# EAGLE design Final Schematic (EAGLE 6.5.0)
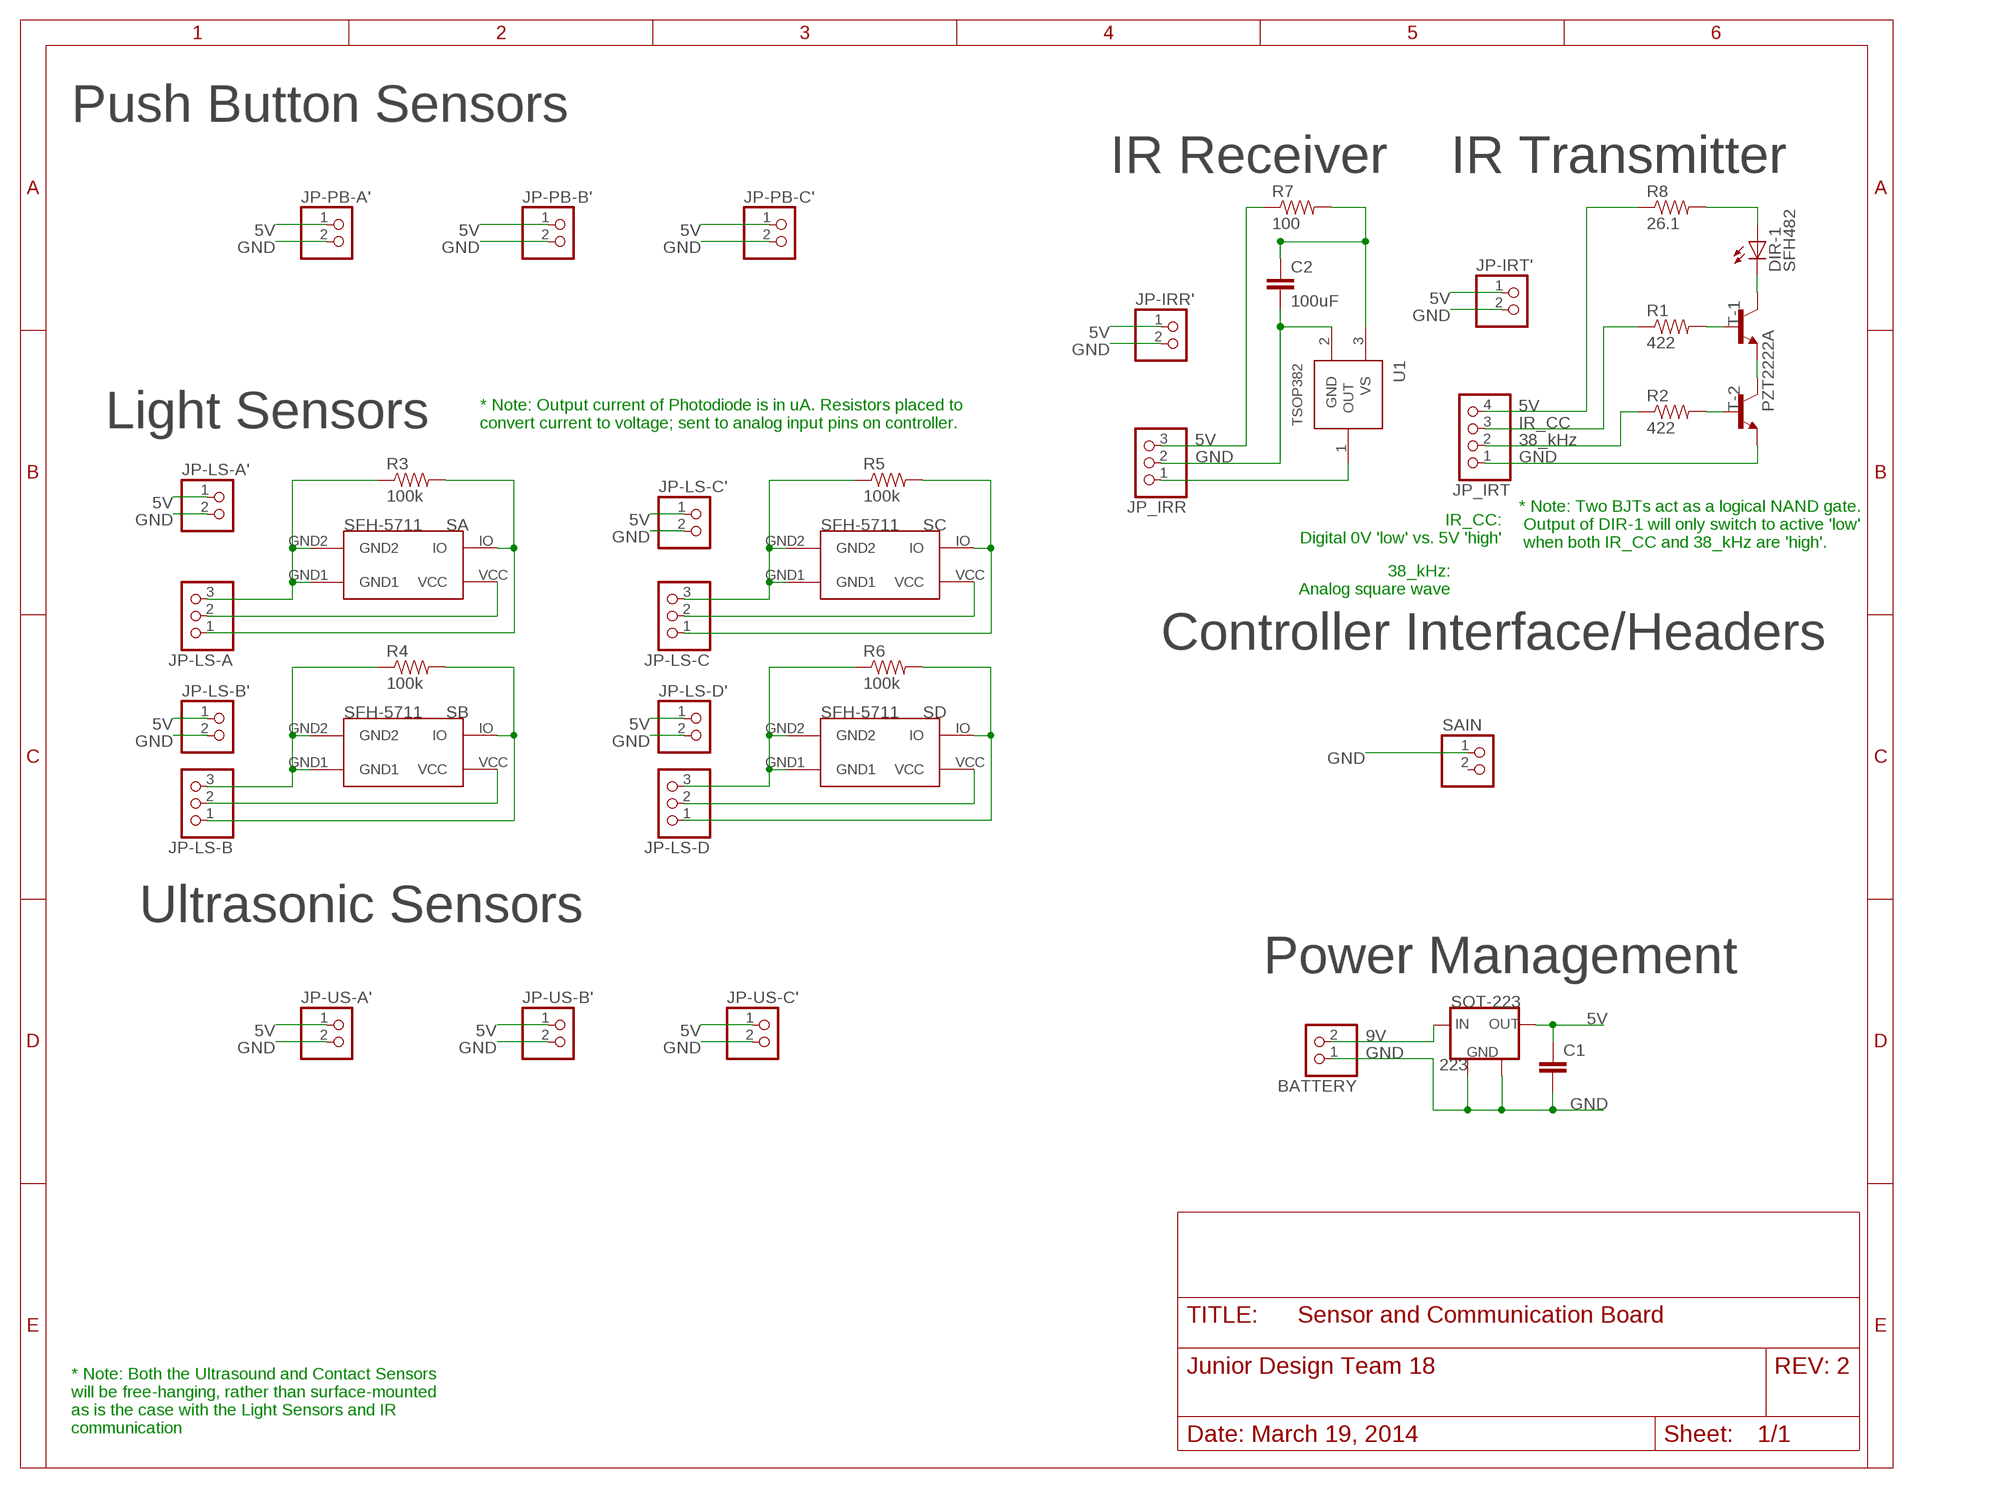
[diagram p0: schematic, sheet 1]

## Parts
BATTERY  PINHD-1X2  [1X02]
C1  CAP0603-CAP  [0603-CAP]
C2  100uF  CAP1206  [1206]
DIR-1  SFH482  [SFH482]
JP-IRR'  PINHD-1X2  [1X02]
JP-IRT'  PINHD-1X2  [1X02]
JP-LS-A  PINHD-1X3  [1X03]
JP-LS-A'  PINHD-1X2  [1X02]
JP-LS-B  PINHD-1X3  [1X03]
JP-LS-B'  PINHD-1X2  [1X02]
JP-LS-C  PINHD-1X3  [1X03]
JP-LS-C'  PINHD-1X2  [1X02]
JP-LS-D  PINHD-1X3  [1X03]
JP-LS-D'  PINHD-1X2  [1X02]
JP-PB-A'  PINHD-1X2  [1X02]
JP-PB-B'  PINHD-1X2  [1X02]
JP-PB-C'  PINHD-1X2  [1X02]
JP-US-A'  PINHD-1X2  [1X02]
JP-US-B'  PINHD-1X2  [1X02]
JP-US-C'  PINHD-1X2  [1X02]
JP_IRR  PINHD-1X3  [1X03]
JP_IRT  PINHD-1X4  [1X04]
R1  422  RESISTOR2512  [R2512]
R2  422  RESISTOR2512  [R2512]
R3  100k  RESISTOR0805-RES  [0805]
R4  100k  RESISTOR0805-RES  [0805]
R5  100k  RESISTOR0805-RES  [0805]
R6  100k  RESISTOR0805-RES  [0805]
R7  100  RESISTOR0805-RES  [0805]
R8  26.1  RESISTOR2512  [R2512]
SAIN  PINHD-1X2  [1X02]
SFH-5711-A  5711  SFH5711  [DIODE]
SFH-5711-B  5711  SFH5711  [DIODE]
SFH-5711-C  5711  SFH5711  [DIODE]
SFH-5711-D  5711  SFH5711  [DIODE]
SOT-223  223  V_REG_LM1117SOT223  [SOT223]
T-1  PZT2222A  [SOT223]
T-2  PZT2222A  [SOT223]
U1  TSOP382  [TSOP382]

## Nets
5V: C1.1 JP-IRR'.1 JP-IRT'.1 JP-LS-A'.1 JP-LS-B'.1 JP-LS-C'.1 JP-LS-D'.1 JP-PB-A'.1 JP-PB-B'.1 JP-PB-C'.1 JP-US-A'.1 JP-US-B'.1 JP-US-C'.1 SOT-223.GND1(OUT)
9V-BAT: BATTERY.2 SOT-223.OUT(IN)
GND: BATTERY.1 C1.2 JP-IRR'.2 JP-IRT'.2 JP-LS-A'.2 JP-LS-B'.2 JP-LS-C'.2 JP-LS-D'.2 JP-PB-A'.2 JP-PB-B'.2 JP-PB-C'.2 JP-US-A'.2 JP-US-B'.2 JP-US-C'.2 SAIN.1 SOT-223.GND2(GND1) SOT-223.IN(GND2)
GND-IR-R: C2.2 JP_IRR.2 U1.2(GND)
GND-IR-T: JP_IRT.1 T-2.3(E)
GND-LS-A: JP-LS-A.3 R3.1 SFH-5711-A.GND1 SFH-5711-A.GND2
GND-LS-B: JP-LS-B.3 R4.1 SFH-5711-B.GND1 SFH-5711-B.GND2
GND-LS-C: JP-LS-C.3 R5.1 SFH-5711-C.GND1 SFH-5711-C.GND2
GND-LS-D: JP-LS-D.3 R6.1 SFH-5711-D.GND1 SFH-5711-D.GND2
IO-LS-A: JP-LS-A.1 R3.2 SFH-5711-A.IO
IO-LS-B: JP-LS-B.1 R4.2 SFH-5711-B.IO
IO-LS-C: JP-LS-C.1 R5.2 SFH-5711-C.IO
IO-LS-D: JP-LS-D.1 R6.2 SFH-5711-D.IO
N$1: DIR-1.A R8.2
N$2: DIR-1.K(C) T-1.2(C) T-1.4(C)
N$4: R2.2 T-2.1(B)
N$5: R1.2 T-1.1(B)
N$6: T-1.3(E) T-2.2(C) T-2.4(C)
VCC-IR-R: JP_IRR.3 R7.1
VCC-IR-T: JP_IRT.4 R8.1
VCC-LS-A: JP-LS-A.2 SFH-5711-A.VCC
VCC-LS-B: JP-LS-B.2 SFH-5711-B.VCC
VCC-LS-C: JP-LS-C.2 SFH-5711-C.VCC
VCC-LS-D: JP-LS-D.2 SFH-5711-D.VCC
VIN-IR-1: JP_IRT.3 R1.1
VIN-IR-2: JP_IRT.2 R2.1
VOUT-IR-R: JP_IRR.1 U1.1(OUT)
VS-IR-R: C2.1 R7.2 U1.3(VS)
Unconnected: SAIN.2

## Notes on the sheet
- Push Button Sensors
- IR Receiver | IR Transmitter
- 5V | 5V | 5V
- GND | GND | GND
- 5V
- GND
- 5V
- GND
- 5V
- Light Sensors
- * Note: Output current of Photodiode is in uA. Resistors placed to
  convert current to voltage; sent to analog input pins on controller.
- IR_CC
- 5V | 38_kHz
- GND | GND
- 5V
- GND | 5V
- IR_CC:
  Digital 0V 'low' vs. 5V 'high'
- SFH-5711 | SA | GND | SFH-5711 | SC
- * Note: Two BJTs act as a logical NAND gate.
   Output of DIR-1 will only switch to active 'low'
   when both IR_CC and 38_kHz are 'high'.
- 38_kHz:
  Analog square wave
- Controller Interface/Headers
- 5V | SFH-5711 | SB | 5V | SFH-5711 | SD
- GND | GND
- GND
- Ultrasonic Sensors
- Power Management
- 5V | 5V | 5V | 5V
- GND | GND | GND | 9V
- GND
- GND
- * Note: Both the Ultrasound and Contact Sensors
  will be free-hanging, rather than surface-mounted
  as is the case with the Light Sensors and IR
  communication

## Library data of the parts
BATTERY JP-IRR' JP-IRT' JP-LS-A' JP-LS-B' JP-LS-C' JP-LS-D' JP-PB-A' JP-PB-B' JP-PB-C' JP-US-A' JP-US-B' JP-US-C' SAIN = pinhead:PINHD-1X2: PIN HEADER
C1 C2 = beacon_board:CAP: Capacitor Standard 0603 ceramic capacitor, and 0.1" leaded capacitor.
DIR-1 = led:SFH482: IR LED infrared emitting diode, Infineon
JP-LS-A JP-LS-B JP-LS-C JP-LS-D JP_IRR = pinhead:PINHD-1X3: PIN HEADER
JP_IRT = pinhead:PINHD-1X4: PIN HEADER
R1-R8 = beacon_board:RESISTOR: Resistor Basic schematic elements and footprints for 0603, 1206, and PTH resistors.
SFH-5711-A SFH-5711-B SFH-5711-C SFH-5711-D = JDT-18:SFH5711: SFH 5711 - Photodiode with Built-In Current Amplifier
SOT-223 = JDT-18:V_REG_LM1117: Voltage Regulator LM1117 Standard adjustable voltage regulator but in SMD form. Spark Fun Electronics SKU : COM-00595
T-1 T-2 = beacon_board:PZT2222A
U1 = beacon_board:TSOP382: Vishay IR receiver module

## Net classes
0 default: width 0.152 mm, drill 0.33 mm

## Board
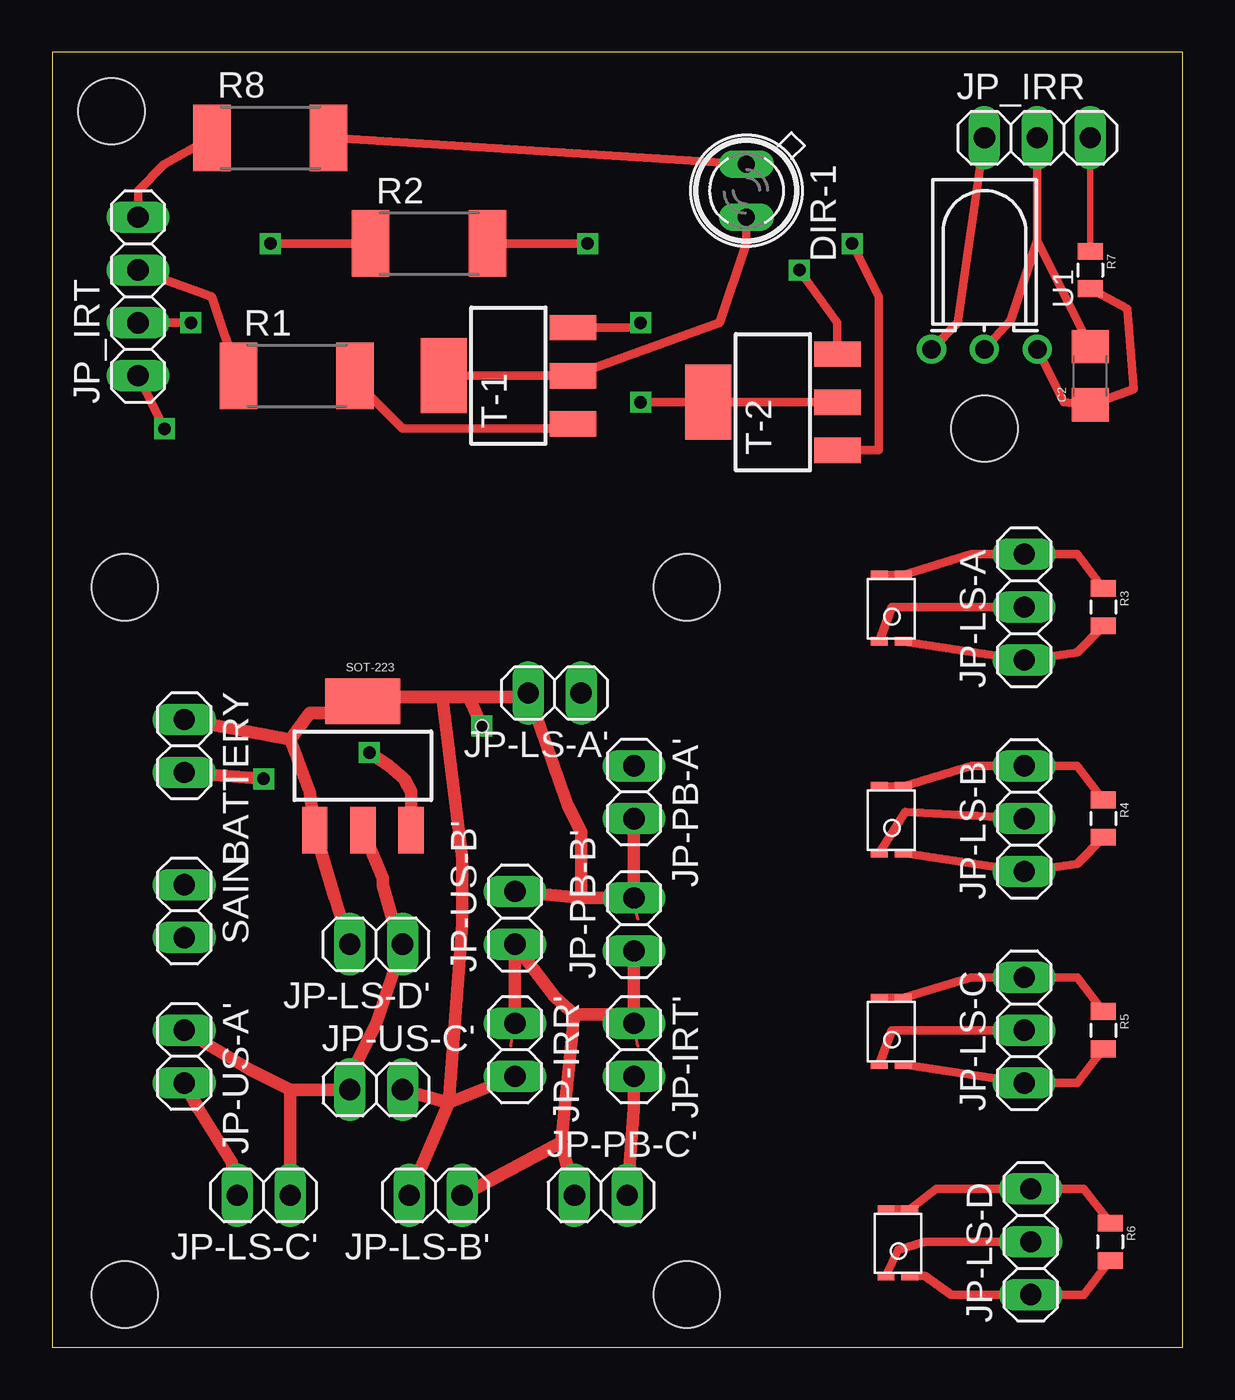
[diagram p1: board, top side]
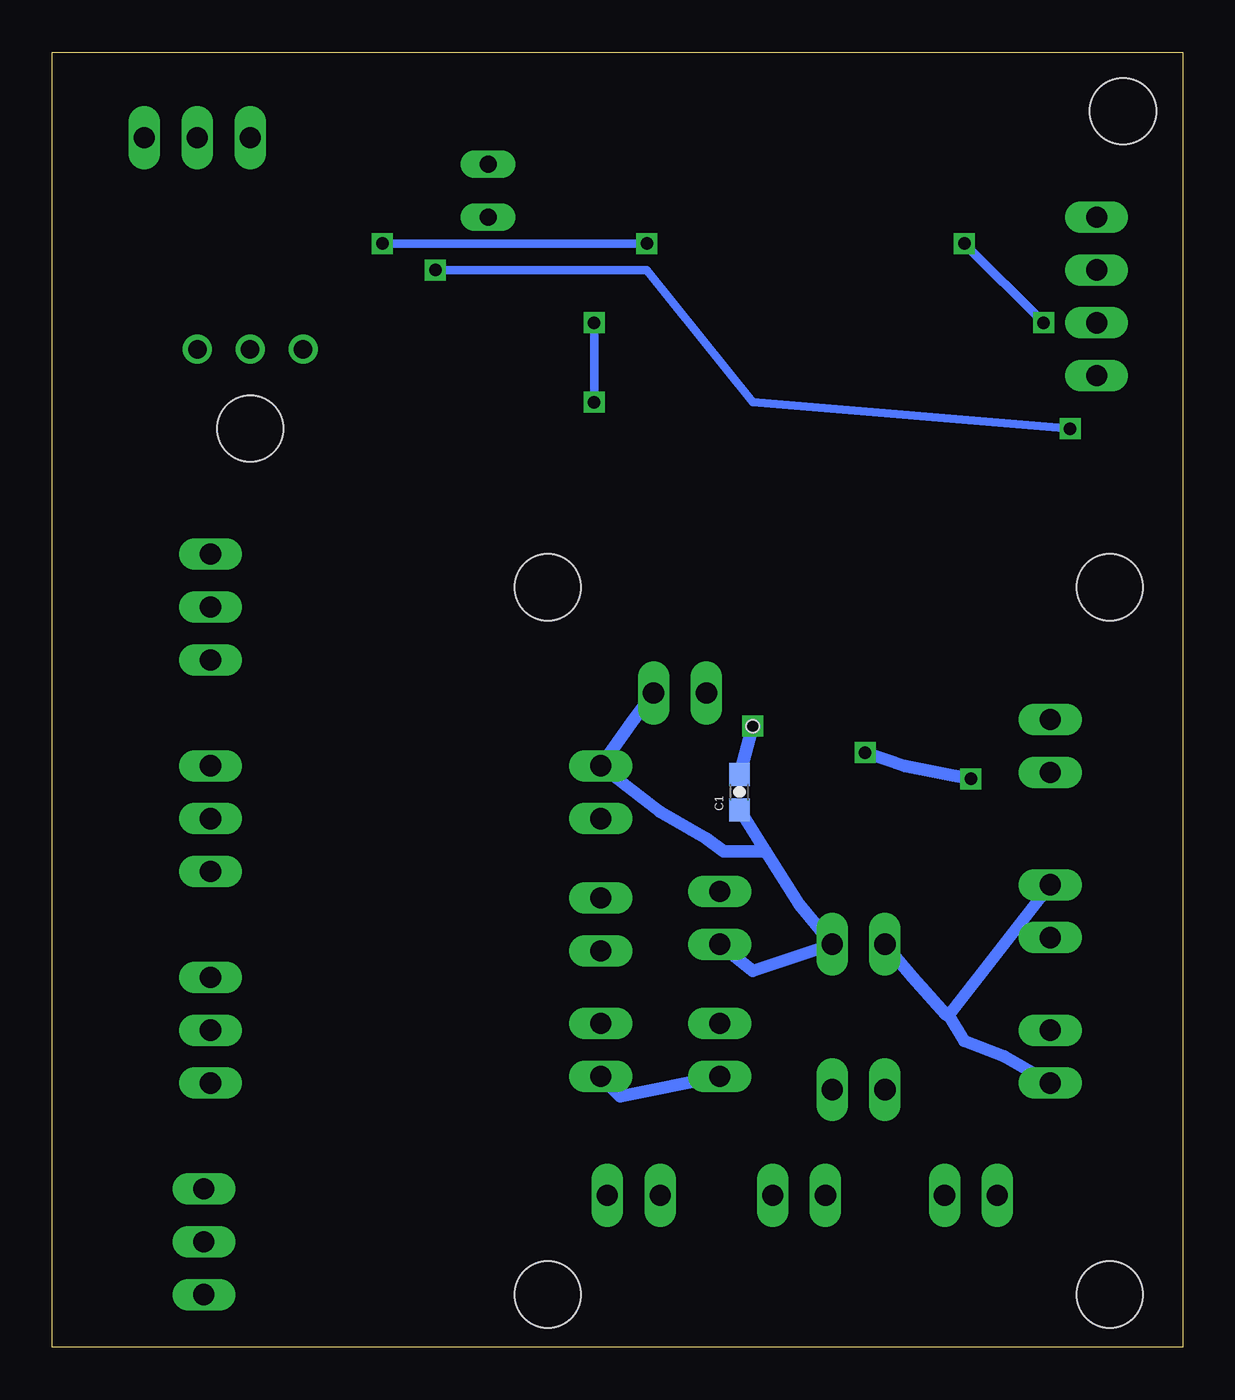
[diagram p2: board, bottom side, seen from below]

Size 54.28 x 62.22 mm. Coordinates in mm from the lower left corner, seen from the top.
Outline: 0,0 54.28,0 54.28,62.22 0,62.22 0,0
Copper layers (1*16): Top 0.035mm / dielectric 1.5mm / Bottom 0.035mm
Design rules "default *": minimum track width 0.001525mm, minimum drill 24mil, track to track 8mil, track to pad 8mil, pad to pad 8mil, via to via 8mil, smd to smd 8mil, copper to edge 40mil, drill to drill 8mil, minimum pad ring 10mil, minimum via ring 8mil, stop-mask expansion 4mil, vias tented up to drill 0mil, thermal gap 10mil
Holes 3.17 mm at 30.48,36.51 30.48,2.54 44.77,44.13 2.86,59.37 3.49,36.51 3.49,2.54
Holes 0.6 mm at 20.64,29.84

### Footprints (pad centres in the part's own frame; a part is rotated, then mirrored left to right if it is on the bottom)
1X02 = drill 1.016 long: 1 -1.27,0; 2 1.27,0
0603-CAP = smd 1.1 x 1: 1 -0.85,0; 2 0.85,0
1206 = smd 1.6 x 1.8: 1 -1.4,0; 2 1.4,0
SFH482 = drill 0.813 long: A -1.27,0; K 1.27,0
1X03 = drill 1.016 long: 1 -2.54,0; 2 0,0; 3 2.54,0
1X04 = drill 1.016 long: 1 -3.81,0; 2 -1.27,0; 3 1.27,0; 4 3.81,0
R2512 = smd 1.8 x 3.2: 1 -2.8,0; 2 2.8,0
0805 = smd 0.8 x 1.2: 1 -0.9,0; 2 0.9,0
DIODE = smd 0.813 x 0.406: GND1 -0.6,1.55; GND2 0.55,1.55; IO 0.55,-1.65; VCC -0.6,-1.65
SOT223 = smd 1.219 x 2.235: GND1 0,-3.099; IN -2.311,-3.099; OUT 2.311,-3.099 | smd 3.6 x 2.2: GND2 0,3.099
SOT223' = smd 1.219 x 2.235: 1 -2.311,-3.099; 2 0,-3.099; 3 2.311,-3.099 | smd 3.6 x 2.2: 4 0,3.099
TSOP382 = drill 0.889: 1 -2.54,0; 2 0,0; 3 2.54,0

### Placement (x,y rotation side)
BATTERY  6.35,28.89 270 top
C1  21.27,26.67 90 bottom
C2  49.85,46.67 90 top
DIR-1  33.34,55.56 270 top
JP-IRR'  22.23,14.29 270 top
JP-IRT'  27.94,14.29 270 top
JP-LS-A  46.67,35.56 90 top
JP-LS-A'  24.13,31.43 180 top
JP-LS-B  46.67,25.4 90 top
JP-LS-B'  18.41,7.3 180 top
JP-LS-C  46.67,15.24 90 top
JP-LS-C'  10.16,7.3 180 top
JP-LS-D  46.99,5.08 90 top
JP-LS-D'  15.56,19.37 180 top
JP-PB-A'  27.94,26.67 270 top
JP-PB-B'  27.94,20.32 90 top
JP-PB-C'  26.35,7.3 0 top
JP-US-A'  6.35,13.97 270 top
JP-US-B'  22.23,20.64 90 top
JP-US-C'  15.56,12.38 0 top
JP_IRR  47.31,58.1 0 top
JP_IRT  4.13,50.48 90 top
R1  11.75,46.67 0 top
R2  18.1,53.02 0 top
R3  50.48,35.56 270 top
R4  50.48,25.4 270 top
R5  50.48,15.24 270 top
R6  50.8,5.08 270 top
R7  49.85,51.75 270 top
R8  10.48,58.1 0 top
SAIN  6.35,20.95 270 top
SFH-5711-A  40.32,35.56 0 top
SFH-5711-B  40.32,25.4 0 top
SFH-5711-C  40.32,15.24 0 top
SFH-5711-D  40.64,5.08 0 top
SOT-223  14.92,27.94 0 top
T-1  PZT2222A  [SOT223']  21.91,46.67 90 top
T-2  PZT2222A  [SOT223']  34.61,45.4 90 top
U1  44.77,47.94 0 top

### Tracks (layer width: path | path; a pad name or v marks a point on that pad's centre or on a via)
5V
  Top 0.152: 14.41,25.15 SOT-223.GND1 | 28.13,14.48 JP-IRT'.1 | 22.04,14.48 JP-IRR'.1
  Top 0.61: JP-US-A'.1 9.53,13.34 11.43,12.38 | 11.43,12.38 JP-LS-C'.1 | 11.43,12.38 JP-US-C'.1 14.29,13.02 15.56,15.56 JP-LS-D'.1 16.51,20 15.88,22.23 15.88,22.54 SOT-223.GND1 | JP-IRR'.1 JP-US-B'.1 24.13,16.83 25.08,16 | 25.08,16 27.94,16 | 27.94,16 JP-IRT'.1 | JP-PB-B'.1 27.94,16 | 25.08,16 24.45,9.84 | 24.45,9.84 JP-PB-C'.1 | JP-LS-B'.1 24.45,9.84
  Bottom 0.152: 22.04,23.62 22.04,23.81
  Bottom 0.61: C1.1 20,23.81 | 20,23.81 22.04,23.81 22.86,24.45 25.08,25.72 JP-PB-A'.1 26.35,30.16 JP-LS-A'.1 | 20,23.81 18.41,21.27 JP-LS-D'.1 20.64,18.1 JP-US-B'.1
9V-BAT  (via drill 0.6)
  Top 0.61: v15.24,28.57 16.19,27.94 16.92,27.3 17.23,26.67 SOT-223.OUT | BATTERY.2 v10.16,27.3
  Bottom 0.61: v15.24,28.57 13.34,27.94 v10.16,27.3
GND  (via drill 0.6)
  Top 0.152: 28.13,20.57 JP-PB-B'.2 | 15.94,31.24 SOT-223.GND2
  Top 0.61: 11.43,29.21 12.38,26.67 SOT-223.IN 13.56,21.59 JP-LS-D'.2 | 11.43,29.21 12.38,30.48 14.92,30.48 SOT-223.GND2 | 11.43,29.21 BATTERY.1 | JP-US-A'.2 7.05,11.43 8.64,8.89 JP-LS-C'.2 | v20.64,29.84 20,31.24 | 18.73,31.24 20,31.24 | 20,31.24 22.86,31.24 JP-LS-A'.2 24.77,26.04 25.4,24.77 25.4,21.59 | 15.94,31.24 18.73,31.24 | 18.73,31.24 19.68,23.5 19.68,20.32 19.05,11.75 | JP-US-B'.2 25.4,21.59 | 25.4,21.59 JP-PB-B'.2 JP-PB-A'.2 | JP-IRT'.2 27.94,11.43 JP-PB-C'.2 | JP-US-C'.2 19.05,11.75 | 19.05,11.75 JP-LS-B'.2 | 19.05,12.06 19.05,11.75 | 19.05,11.75 JP-IRR'.2
  Bottom 0.152: 11.37,16 11.26,15.92
  Bottom 0.61: SAIN.1 11.26,15.92 11.26,16 10.48,14.73 8.57,13.97 JP-US-A'.2 | JP-LS-D'.2 12.95,17.78 11.37,16 | C1.2 v20.64,29.84 | JP-IRR'.2 26.99,12.06 JP-IRT'.2
GND-IR-R
  Top 0.406: U1.2 46.04,49.34 47.31,53.15 | JP_IRR.2 47.31,53.15 | 47.31,53.15 C2.2
GND-IR-T  (via drill 0.6)
  Top 0.406: JP_IRT.1 v5.4,44.13 | v35.88,51.75 37.71,49.21 T-2.3
  Bottom 0.406: v5.4,44.13 20.64,45.4 25.72,51.75 v35.88,51.75
GND-LS-A
  Top 0.406: SFH-5711-A.GND1 SFH-5711-A.GND2 44.13,38.1 JP-LS-A.3 49.21,38.1 R3.1
GND-LS-B
  Top 0.406: SFH-5711-B.GND1 SFH-5711-B.GND2 44.13,27.94 JP-LS-B.3 49.21,27.94 R4.1
GND-LS-C
  Top 0.406: SFH-5711-C.GND1 SFH-5711-C.GND2 44.13,17.78 JP-LS-C.3 49.21,17.78 R5.1
GND-LS-D
  Top 0.406: SFH-5711-D.GND1 SFH-5711-D.GND2 42.46,7.62 JP-LS-D.3 49.53,7.62 R6.1
IO-LS-A
  Top 0.406: R3.2 49.21,33.39 JP-LS-A.1 SFH-5711-A.IO
IO-LS-B
  Top 0.406: R4.2 49.21,23.23 JP-LS-B.1 SFH-5711-B.IO
IO-LS-C
  Top 0.406: SFH-5711-C.IO JP-LS-C.1 49.21,12.7 R5.2
IO-LS-D
  Top 0.406: R6.2 49.53,2.54 JP-LS-D.1 43.18,2.54 41.91,3.43 SFH-5711-D.IO
N$1
  Top 0.406: R8.2 DIR-1.A
N$2
  Top 0.406: DIR-1.K 33.34,53.02 32.07,49.21 T-1.2 T-1.4
N$4  (via drill 0.6)
  Top 0.406: v25.72,53.02 R2.2 | v38.42,53.02 39.69,50.48 39.69,43.09 T-2.1
  Bottom 0.406: v38.42,53.02 v25.72,53.02
N$5
  Top 0.406: R1.2 14.29,46.67 16.83,44.13 25.01,44.13 T-1.1
N$6  (via drill 0.6)
  Top 0.406: T-1.3 28.26,48.98 v28.26,49.21 | v28.26,45.4 T-2.4 T-2.2
  Bottom 0.406: v28.26,49.21 v28.26,45.4
VCC-IR-R
  Top 0.305: JP_IRR.3 R7.1
VCC-IR-T
  Top 0.406: R8.1 5.4,56.83 4.13,55.56 JP_IRT.4
VCC-LS-A
  Top 0.406: SFH-5711-A.VCC 40.32,35.56 JP-LS-A.2
VCC-LS-B
  Top 0.406: SFH-5711-B.VCC 40.96,25.72 JP-LS-B.2
VCC-LS-C
  Top 0.406: JP-LS-C.2 40.32,15.24 SFH-5711-C.VCC
VCC-LS-D
  Top 0.406: SFH-5711-D.VCC 40.64,4.7 41.91,5.08 JP-LS-D.2
VIN-IR-1
  Top 0.406: JP_IRT.3 7.68,50.48 R1.1
VIN-IR-2  (via drill 0.6)
  Top 0.406: JP_IRT.2 v6.67,49.21 | v10.48,53.02 R2.1
  Bottom 0.406: v6.67,49.21 v10.48,53.02
VOUT-IR-R
  Top 0.406: JP_IRR.1 43.5,49.21 U1.1
VS-IR-R
  Top 0.406: U1.3 48.58,45.4 C2.1 51.94,46.04 51.63,49.9 R7.2

### Text on the board
tDocu: JD-18-ZF-XZ-KH-V2